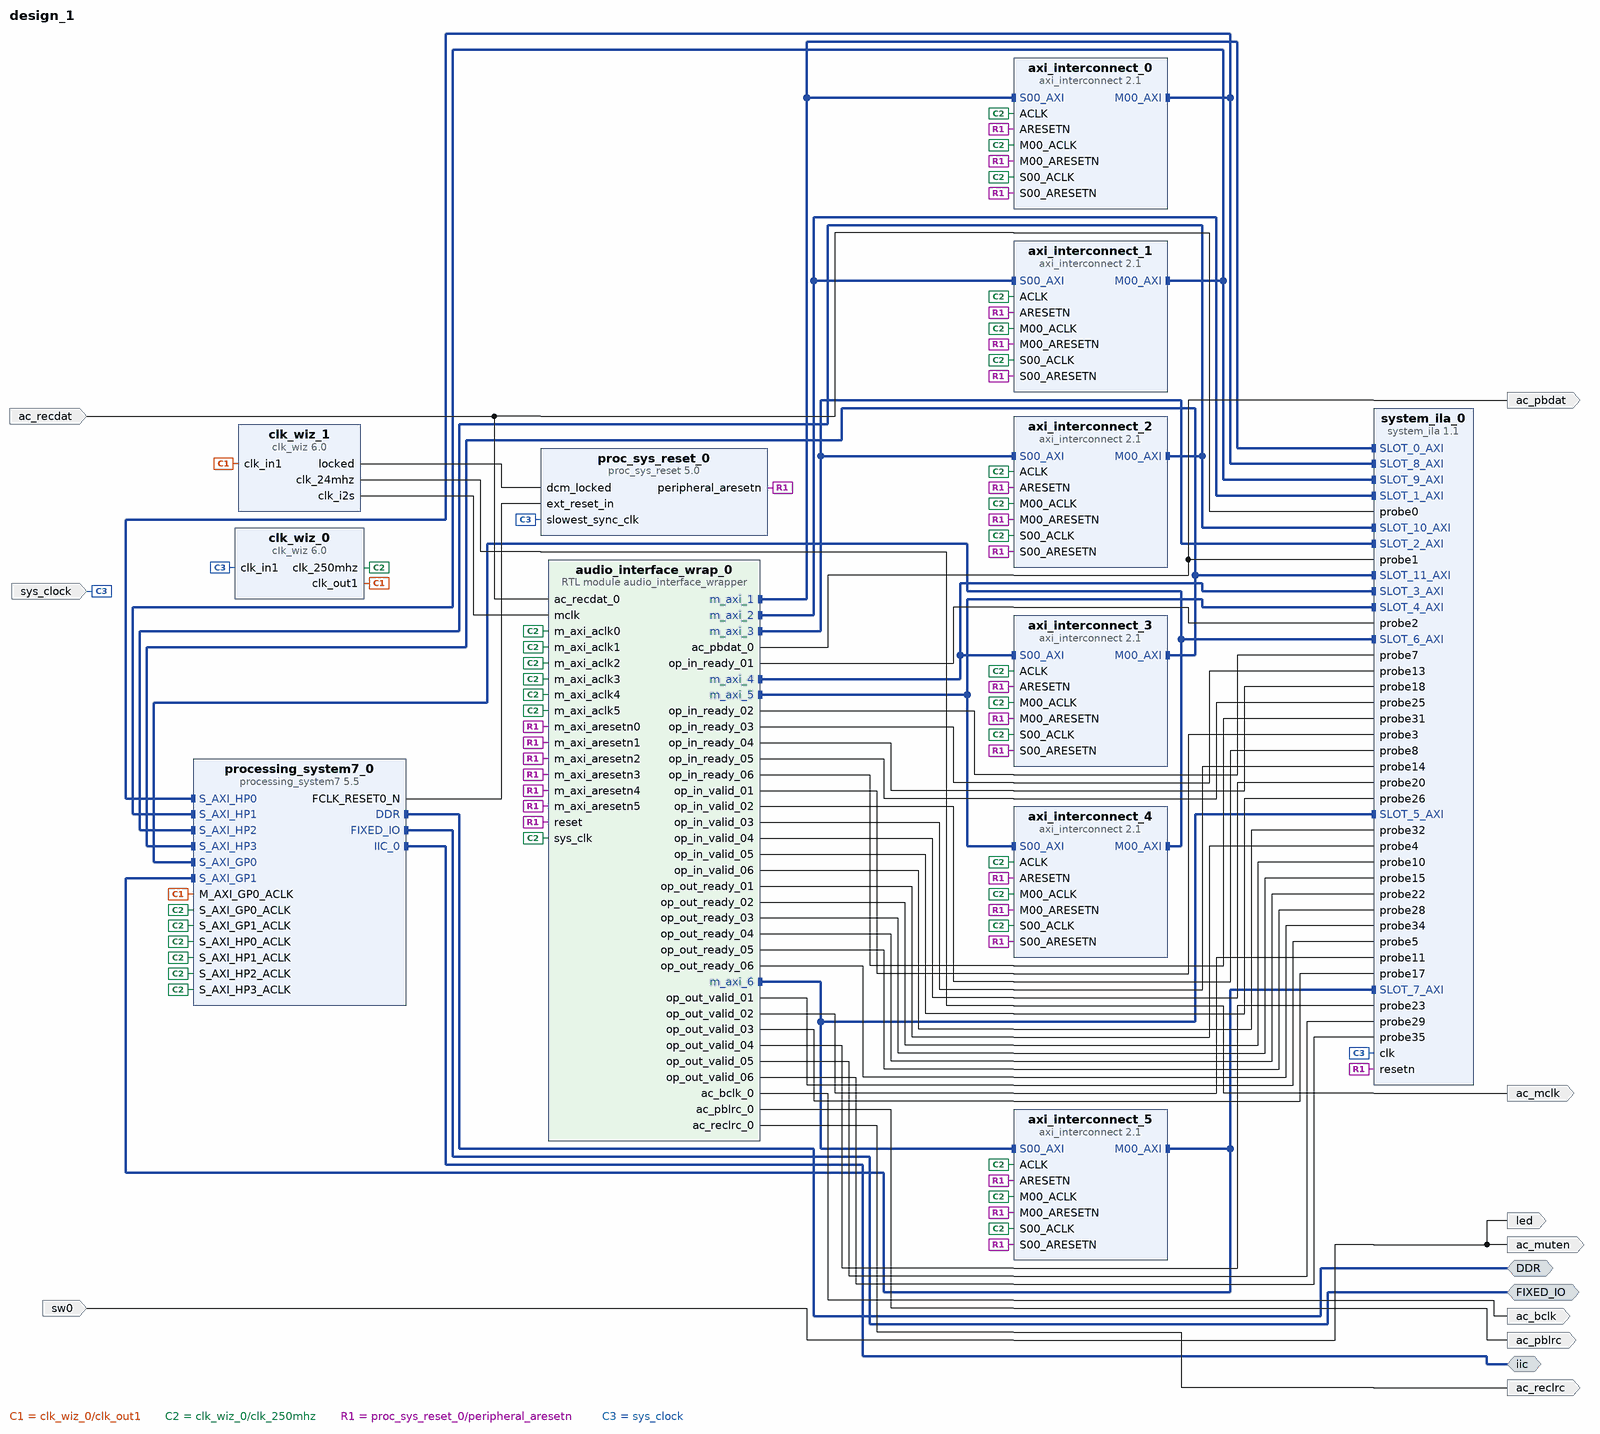
[diagram p0: block diagram of the top level]
# Vivado block design design_1, xc7z020clg400-1, Vivado 2022.2
create_bd_design design_1

create_bd_intf_port -mode Master -vlnv xilinx.com:interface:ddrx_rtl:1.0 DDR
create_bd_intf_port -mode Master -vlnv xilinx.com:display_processing_system7:fixedio_rtl:1.0 FIXED_IO
create_bd_intf_port -mode Master -vlnv xilinx.com:interface:iic_rtl:1.0 iic
create_bd_port -dir O ac_pblrc
create_bd_port -dir O ac_bclk
create_bd_port -dir O ac_pbdat
create_bd_port -dir O ac_reclrc
create_bd_port -dir I ac_recdat
create_bd_port -dir I sys_clock
create_bd_port -dir O -type clk ac_mclk
create_bd_port -dir I sw0
create_bd_port -dir O ac_muten
create_bd_port -dir O led

create_bd_cell -type ip -vlnv xilinx.com:ip:processing_system7:5.5 processing_system7_0
set_property -dict [list \
  CONFIG.PCW_APU_PERIPHERAL_FREQMHZ 667 \
  CONFIG.PCW_ENET0_ENET0_IO {MIO 16 .. 27} \
  CONFIG.PCW_ENET0_GRP_MDIO_ENABLE 1 \
  CONFIG.PCW_ENET0_GRP_MDIO_IO {MIO 52 .. 53} \
  CONFIG.PCW_ENET0_PERIPHERAL_ENABLE 1 \
  CONFIG.PCW_ENET0_RESET_ENABLE 0 \
  CONFIG.PCW_ENET_RESET_ENABLE 1 \
  CONFIG.PCW_ENET_RESET_SELECT {Share reset pin} \
  CONFIG.PCW_GPIO_MIO_GPIO_ENABLE 1 \
  CONFIG.PCW_GPIO_MIO_GPIO_IO MIO \
  CONFIG.PCW_I2C0_I2C0_IO EMIO \
  CONFIG.PCW_I2C0_PERIPHERAL_ENABLE 1 \
  CONFIG.PCW_I2C_PERIPHERAL_FREQMHZ 111.111115 \
  CONFIG.PCW_I2C_RESET_ENABLE 1 \
  CONFIG.PCW_I2C_RESET_SELECT {Share reset pin} \
  CONFIG.PCW_PRESET_BANK1_VOLTAGE {LVCMOS 1.8V} \
  CONFIG.PCW_QSPI_GRP_FBCLK_ENABLE 1 \
  CONFIG.PCW_QSPI_GRP_FBCLK_IO {MIO 8} \
  CONFIG.PCW_QSPI_GRP_SINGLE_SS_ENABLE 1 \
  CONFIG.PCW_QSPI_GRP_SINGLE_SS_IO {MIO 1 .. 6} \
  CONFIG.PCW_QSPI_PERIPHERAL_ENABLE 1 \
  CONFIG.PCW_QSPI_QSPI_IO {MIO 1 .. 6} \
  CONFIG.PCW_SD0_GRP_CD_ENABLE 1 \
  CONFIG.PCW_SD0_GRP_CD_IO {MIO 47} \
  CONFIG.PCW_SD0_GRP_WP_ENABLE 0 \
  CONFIG.PCW_SD0_PERIPHERAL_ENABLE 1 \
  CONFIG.PCW_SD0_SD0_IO {MIO 40 .. 45} \
  CONFIG.PCW_SDIO_PERIPHERAL_FREQMHZ 50 \
  CONFIG.PCW_SINGLE_QSPI_DATA_MODE x4 \
  CONFIG.PCW_S_AXI_HP0_DATA_WIDTH 32 \
  CONFIG.PCW_S_AXI_HP1_DATA_WIDTH 32 \
  CONFIG.PCW_S_AXI_HP2_DATA_WIDTH 32 \
  CONFIG.PCW_S_AXI_HP3_DATA_WIDTH 32 \
  CONFIG.PCW_UART1_PERIPHERAL_ENABLE 1 \
  CONFIG.PCW_UART1_UART1_IO {MIO 48 .. 49} \
  CONFIG.PCW_UART_PERIPHERAL_FREQMHZ 100 \
  CONFIG.PCW_UIPARAM_DDR_FREQ_MHZ 533.333333 \
  CONFIG.PCW_UIPARAM_DDR_MEMORY_TYPE {DDR 3 (Low Voltage)} \
  CONFIG.PCW_UIPARAM_DDR_PARTNO {MT41K256M16 RE-125} \
  CONFIG.PCW_USB0_PERIPHERAL_ENABLE 1 \
  CONFIG.PCW_USB0_RESET_ENABLE 1 \
  CONFIG.PCW_USB0_RESET_IO {MIO 46} \
  CONFIG.PCW_USB0_USB0_IO {MIO 28 .. 39} \
  CONFIG.PCW_USB_RESET_ENABLE 1 \
  CONFIG.PCW_USB_RESET_SELECT {Share reset pin} \
  CONFIG.PCW_USE_S_AXI_GP0 1 \
  CONFIG.PCW_USE_S_AXI_GP1 1 \
  CONFIG.PCW_USE_S_AXI_HP0 1 \
  CONFIG.PCW_USE_S_AXI_HP1 1 \
  CONFIG.PCW_USE_S_AXI_HP2 1 \
  CONFIG.PCW_USE_S_AXI_HP3 1 \
] [get_bd_cells processing_system7_0]
# 299 more settings of processing_system7_0 are not shown: defaults, MIO pin electricals, DDR timing, and values the tool derives
create_bd_cell -type ip -vlnv xilinx.com:ip:clk_wiz:6.0 clk_wiz_0
set_property -dict [list \
  CONFIG.CLKOUT1_JITTER 161.803 \
  CONFIG.CLKOUT1_PHASE_ERROR 160.491 \
  CONFIG.CLKOUT1_REQUESTED_OUT_FREQ 122.885835 \
  CONFIG.CLKOUT2_JITTER 197.162 \
  CONFIG.CLKOUT2_PHASE_ERROR 160.491 \
  CONFIG.CLKOUT2_REQUESTED_OUT_FREQ 250 \
  CONFIG.CLKOUT2_USED true \
  CONFIG.CLK_OUT2_PORT clk_250mhz \
  CONFIG.MMCM_CLKFBOUT_MULT_F 37.625 \
  CONFIG.MMCM_CLKOUT0_DIVIDE_F 6.125 \
  CONFIG.MMCM_CLKOUT1_DIVIDE 3 \
  CONFIG.MMCM_DIVCLK_DIVIDE 5 \
  CONFIG.NUM_OUT_CLKS 2 \
  CONFIG.USE_LOCKED false \
  CONFIG.USE_RESET false \
] [get_bd_cells clk_wiz_0]
create_bd_cell -type ip -vlnv xilinx.com:ip:clk_wiz:6.0 clk_wiz_1
set_property -dict [list \
  CONFIG.CLKOUT1_JITTER 283.526 \
  CONFIG.CLKOUT1_PHASE_ERROR 290.353 \
  CONFIG.CLKOUT1_REQUESTED_OUT_FREQ 12.288 \
  CONFIG.CLKOUT2_JITTER 252.819 \
  CONFIG.CLKOUT2_PHASE_ERROR 290.353 \
  CONFIG.CLKOUT2_REQUESTED_OUT_FREQ 24.576 \
  CONFIG.CLKOUT2_USED true \
  CONFIG.CLK_OUT1_PORT clk_i2s \
  CONFIG.CLK_OUT2_PORT clk_24mhz \
  CONFIG.MMCM_CLKFBOUT_MULT_F 56.375 \
  CONFIG.MMCM_CLKOUT0_DIVIDE_F 93.875 \
  CONFIG.MMCM_CLKOUT1_DIVIDE 47 \
  CONFIG.MMCM_DIVCLK_DIVIDE 6 \
  CONFIG.NUM_OUT_CLKS 2 \
  CONFIG.USE_RESET false \
] [get_bd_cells clk_wiz_1]
create_bd_cell -type ip -vlnv xilinx.com:ip:proc_sys_reset:5.0 proc_sys_reset_0
create_bd_cell -type ip -vlnv xilinx.com:ip:axi_interconnect:2.1 axi_interconnect_0
set_property -dict {CONFIG.NUM_MI 1} [get_bd_cells axi_interconnect_0]
create_bd_cell -type ip -vlnv xilinx.com:ip:axi_interconnect:2.1 axi_interconnect_1
set_property -dict {CONFIG.NUM_MI 1} [get_bd_cells axi_interconnect_1]
create_bd_cell -type ip -vlnv xilinx.com:ip:axi_interconnect:2.1 axi_interconnect_2
set_property -dict {CONFIG.NUM_MI 1} [get_bd_cells axi_interconnect_2]
create_bd_cell -type ip -vlnv xilinx.com:ip:axi_interconnect:2.1 axi_interconnect_3
set_property -dict {CONFIG.NUM_MI 1} [get_bd_cells axi_interconnect_3]
create_bd_cell -type ip -vlnv xilinx.com:ip:axi_interconnect:2.1 axi_interconnect_4
set_property -dict {CONFIG.NUM_MI 1} [get_bd_cells axi_interconnect_4]
create_bd_cell -type ip -vlnv xilinx.com:ip:axi_interconnect:2.1 axi_interconnect_5
set_property -dict {CONFIG.NUM_MI 1} [get_bd_cells axi_interconnect_5]
create_bd_cell -type ip -vlnv xilinx.com:ip:system_ila:1.1 system_ila_0
set_property -dict {CONFIG.C_MON_TYPE MIX CONFIG.C_NUM_MONITOR_SLOTS 12 CONFIG.C_NUM_OF_PROBES 42} [get_bd_cells system_ila_0]
create_bd_cell -type module -reference audio_interface_wrapper audio_interface_wrap_0

# ---- connections ----

connect_bd_intf_net [get_bd_intf_pins audio_interface_wrap_0/m_axi_1] [get_bd_intf_pins axi_interconnect_0/S00_AXI]
connect_bd_intf_net [get_bd_intf_pins audio_interface_wrap_0/m_axi_1] [get_bd_intf_pins system_ila_0/SLOT_0_AXI]
connect_bd_intf_net [get_bd_intf_pins audio_interface_wrap_0/m_axi_2] [get_bd_intf_pins axi_interconnect_1/S00_AXI]
connect_bd_intf_net [get_bd_intf_pins audio_interface_wrap_0/m_axi_2] [get_bd_intf_pins system_ila_0/SLOT_1_AXI]
connect_bd_intf_net [get_bd_intf_pins audio_interface_wrap_0/m_axi_3] [get_bd_intf_pins axi_interconnect_2/S00_AXI]
connect_bd_intf_net [get_bd_intf_pins audio_interface_wrap_0/m_axi_3] [get_bd_intf_pins system_ila_0/SLOT_2_AXI]
connect_bd_intf_net [get_bd_intf_pins audio_interface_wrap_0/m_axi_4] [get_bd_intf_pins axi_interconnect_3/S00_AXI]
connect_bd_intf_net [get_bd_intf_pins audio_interface_wrap_0/m_axi_4] [get_bd_intf_pins system_ila_0/SLOT_3_AXI]
connect_bd_intf_net [get_bd_intf_pins audio_interface_wrap_0/m_axi_5] [get_bd_intf_pins axi_interconnect_4/S00_AXI]
connect_bd_intf_net [get_bd_intf_pins audio_interface_wrap_0/m_axi_5] [get_bd_intf_pins system_ila_0/SLOT_4_AXI]
connect_bd_intf_net [get_bd_intf_pins audio_interface_wrap_0/m_axi_6] [get_bd_intf_pins axi_interconnect_5/S00_AXI]
connect_bd_intf_net [get_bd_intf_pins audio_interface_wrap_0/m_axi_6] [get_bd_intf_pins system_ila_0/SLOT_5_AXI]
connect_bd_intf_net [get_bd_intf_pins axi_interconnect_0/M00_AXI] [get_bd_intf_pins processing_system7_0/S_AXI_HP0]
connect_bd_intf_net [get_bd_intf_pins axi_interconnect_0/M00_AXI] [get_bd_intf_pins system_ila_0/SLOT_8_AXI]
connect_bd_intf_net [get_bd_intf_pins axi_interconnect_1/M00_AXI] [get_bd_intf_pins processing_system7_0/S_AXI_HP1]
connect_bd_intf_net [get_bd_intf_pins axi_interconnect_1/M00_AXI] [get_bd_intf_pins system_ila_0/SLOT_9_AXI]
connect_bd_intf_net [get_bd_intf_pins axi_interconnect_2/M00_AXI] [get_bd_intf_pins processing_system7_0/S_AXI_HP2]
connect_bd_intf_net [get_bd_intf_pins axi_interconnect_2/M00_AXI] [get_bd_intf_pins system_ila_0/SLOT_10_AXI]
connect_bd_intf_net [get_bd_intf_pins axi_interconnect_3/M00_AXI] [get_bd_intf_pins processing_system7_0/S_AXI_HP3]
connect_bd_intf_net [get_bd_intf_pins axi_interconnect_3/M00_AXI] [get_bd_intf_pins system_ila_0/SLOT_11_AXI]
connect_bd_intf_net [get_bd_intf_pins axi_interconnect_4/M00_AXI] [get_bd_intf_pins processing_system7_0/S_AXI_GP0]
connect_bd_intf_net [get_bd_intf_pins axi_interconnect_4/M00_AXI] [get_bd_intf_pins system_ila_0/SLOT_6_AXI]
connect_bd_intf_net [get_bd_intf_pins axi_interconnect_5/M00_AXI] [get_bd_intf_pins processing_system7_0/S_AXI_GP1]
connect_bd_intf_net [get_bd_intf_pins axi_interconnect_5/M00_AXI] [get_bd_intf_pins system_ila_0/SLOT_7_AXI]
connect_bd_intf_net [get_bd_intf_ports DDR] [get_bd_intf_pins processing_system7_0/DDR]
connect_bd_intf_net [get_bd_intf_ports FIXED_IO] [get_bd_intf_pins processing_system7_0/FIXED_IO]
connect_bd_intf_net [get_bd_intf_ports iic] [get_bd_intf_pins processing_system7_0/IIC_0]
connect_bd_net [get_bd_ports ac_recdat] [get_bd_pins system_ila_0/probe0] [get_bd_pins audio_interface_wrap_0/ac_recdat_0]
connect_bd_net [get_bd_pins audio_interface_wrap_0/ac_bclk_0] [get_bd_ports ac_bclk]
connect_bd_net [get_bd_pins audio_interface_wrap_0/ac_pbdat_0] [get_bd_ports ac_pbdat] [get_bd_pins system_ila_0/probe1]
connect_bd_net [get_bd_pins audio_interface_wrap_0/ac_pblrc_0] [get_bd_ports ac_pblrc]
connect_bd_net [get_bd_pins audio_interface_wrap_0/ac_reclrc_0] [get_bd_ports ac_reclrc]
connect_bd_net [get_bd_pins audio_interface_wrap_0/op_in_ready_01] [get_bd_pins system_ila_0/probe2]
connect_bd_net [get_bd_pins audio_interface_wrap_0/op_in_ready_02] [get_bd_pins system_ila_0/probe7]
connect_bd_net [get_bd_pins audio_interface_wrap_0/op_in_ready_03] [get_bd_pins system_ila_0/probe13]
connect_bd_net [get_bd_pins audio_interface_wrap_0/op_in_ready_04] [get_bd_pins system_ila_0/probe18]
connect_bd_net [get_bd_pins audio_interface_wrap_0/op_in_ready_05] [get_bd_pins system_ila_0/probe25]
connect_bd_net [get_bd_pins audio_interface_wrap_0/op_in_ready_06] [get_bd_pins system_ila_0/probe31]
connect_bd_net [get_bd_pins audio_interface_wrap_0/op_in_valid_01] [get_bd_pins system_ila_0/probe3]
connect_bd_net [get_bd_pins audio_interface_wrap_0/op_in_valid_02] [get_bd_pins system_ila_0/probe8]
connect_bd_net [get_bd_pins audio_interface_wrap_0/op_in_valid_03] [get_bd_pins system_ila_0/probe14]
connect_bd_net [get_bd_pins audio_interface_wrap_0/op_in_valid_04] [get_bd_pins system_ila_0/probe20]
connect_bd_net [get_bd_pins audio_interface_wrap_0/op_in_valid_05] [get_bd_pins system_ila_0/probe26]
connect_bd_net [get_bd_pins audio_interface_wrap_0/op_in_valid_06] [get_bd_pins system_ila_0/probe32]
connect_bd_net [get_bd_pins audio_interface_wrap_0/op_out_ready_01] [get_bd_pins system_ila_0/probe4]
connect_bd_net [get_bd_pins audio_interface_wrap_0/op_out_ready_02] [get_bd_pins system_ila_0/probe10]
connect_bd_net [get_bd_pins audio_interface_wrap_0/op_out_ready_03] [get_bd_pins system_ila_0/probe15]
connect_bd_net [get_bd_pins audio_interface_wrap_0/op_out_ready_04] [get_bd_pins system_ila_0/probe22]
connect_bd_net [get_bd_pins audio_interface_wrap_0/op_out_ready_05] [get_bd_pins system_ila_0/probe28]
connect_bd_net [get_bd_pins audio_interface_wrap_0/op_out_ready_06] [get_bd_pins system_ila_0/probe34]
connect_bd_net [get_bd_pins audio_interface_wrap_0/op_out_valid_01] [get_bd_pins system_ila_0/probe5]
connect_bd_net [get_bd_pins audio_interface_wrap_0/op_out_valid_02] [get_bd_pins system_ila_0/probe11]
connect_bd_net [get_bd_pins audio_interface_wrap_0/op_out_valid_03] [get_bd_pins system_ila_0/probe17]
connect_bd_net [get_bd_pins audio_interface_wrap_0/op_out_valid_04] [get_bd_pins system_ila_0/probe23]
connect_bd_net [get_bd_pins audio_interface_wrap_0/op_out_valid_05] [get_bd_pins system_ila_0/probe29]
connect_bd_net [get_bd_pins audio_interface_wrap_0/op_out_valid_06] [get_bd_pins system_ila_0/probe35]
connect_bd_net [get_bd_pins clk_wiz_0/clk_out1] [get_bd_pins clk_wiz_1/clk_in1] [get_bd_pins processing_system7_0/M_AXI_GP0_ACLK]
connect_bd_net [get_bd_pins clk_wiz_1/clk_24mhz] [get_bd_ports ac_mclk]
connect_bd_net -net clk_wiz_1_clk_i2s [get_bd_pins clk_wiz_0/clk_250mhz] \
  [get_bd_pins axi_interconnect_0/ACLK] [get_bd_pins axi_interconnect_1/ACLK] [get_bd_pins axi_interconnect_2/ACLK] \
  [get_bd_pins axi_interconnect_3/ACLK] [get_bd_pins axi_interconnect_4/ACLK] [get_bd_pins axi_interconnect_5/ACLK] \
  [get_bd_pins axi_interconnect_5/S00_ACLK] [get_bd_pins axi_interconnect_5/M00_ACLK] \
  [get_bd_pins axi_interconnect_2/S00_ACLK] [get_bd_pins axi_interconnect_2/M00_ACLK] \
  [get_bd_pins axi_interconnect_4/S00_ACLK] [get_bd_pins axi_interconnect_4/M00_ACLK] \
  [get_bd_pins axi_interconnect_1/S00_ACLK] [get_bd_pins axi_interconnect_1/M00_ACLK] \
  [get_bd_pins axi_interconnect_0/S00_ACLK] [get_bd_pins axi_interconnect_0/M00_ACLK] \
  [get_bd_pins axi_interconnect_3/S00_ACLK] [get_bd_pins axi_interconnect_3/M00_ACLK] \
  [get_bd_pins processing_system7_0/S_AXI_GP0_ACLK] [get_bd_pins processing_system7_0/S_AXI_GP1_ACLK] \
  [get_bd_pins processing_system7_0/S_AXI_HP0_ACLK] [get_bd_pins processing_system7_0/S_AXI_HP1_ACLK] \
  [get_bd_pins processing_system7_0/S_AXI_HP2_ACLK] [get_bd_pins processing_system7_0/S_AXI_HP3_ACLK] \
  [get_bd_pins audio_interface_wrap_0/sys_clk] [get_bd_pins audio_interface_wrap_0/m_axi_aclk0] \
  [get_bd_pins audio_interface_wrap_0/m_axi_aclk1] [get_bd_pins audio_interface_wrap_0/m_axi_aclk2] \
  [get_bd_pins audio_interface_wrap_0/m_axi_aclk3] [get_bd_pins audio_interface_wrap_0/m_axi_aclk4] \
  [get_bd_pins audio_interface_wrap_0/m_axi_aclk5]
connect_bd_net [get_bd_pins clk_wiz_1/clk_i2s] [get_bd_pins audio_interface_wrap_0/mclk]
connect_bd_net [get_bd_pins clk_wiz_1/locked] [get_bd_pins proc_sys_reset_0/dcm_locked]
connect_bd_net [get_bd_pins proc_sys_reset_0/peripheral_aresetn] \
  [get_bd_pins axi_interconnect_0/ARESETN] [get_bd_pins axi_interconnect_1/ARESETN] [get_bd_pins axi_interconnect_2/ARESETN] \
  [get_bd_pins axi_interconnect_3/ARESETN] [get_bd_pins axi_interconnect_4/ARESETN] [get_bd_pins axi_interconnect_5/ARESETN] \
  [get_bd_pins axi_interconnect_5/M00_ARESETN] [get_bd_pins axi_interconnect_5/S00_ARESETN] \
  [get_bd_pins axi_interconnect_2/S00_ARESETN] [get_bd_pins axi_interconnect_2/M00_ARESETN] \
  [get_bd_pins axi_interconnect_4/S00_ARESETN] [get_bd_pins axi_interconnect_4/M00_ARESETN] \
  [get_bd_pins axi_interconnect_1/S00_ARESETN] [get_bd_pins axi_interconnect_1/M00_ARESETN] \
  [get_bd_pins axi_interconnect_0/S00_ARESETN] [get_bd_pins axi_interconnect_0/M00_ARESETN] \
  [get_bd_pins axi_interconnect_3/S00_ARESETN] [get_bd_pins axi_interconnect_3/M00_ARESETN] [get_bd_pins system_ila_0/resetn] \
  [get_bd_pins audio_interface_wrap_0/reset] [get_bd_pins audio_interface_wrap_0/m_axi_aresetn0] \
  [get_bd_pins audio_interface_wrap_0/m_axi_aresetn1] [get_bd_pins audio_interface_wrap_0/m_axi_aresetn2] \
  [get_bd_pins audio_interface_wrap_0/m_axi_aresetn3] [get_bd_pins audio_interface_wrap_0/m_axi_aresetn4] \
  [get_bd_pins audio_interface_wrap_0/m_axi_aresetn5]
connect_bd_net [get_bd_pins processing_system7_0/FCLK_RESET0_N] [get_bd_pins proc_sys_reset_0/ext_reset_in]
connect_bd_net -net sw0_1 [get_bd_ports sw0] [get_bd_ports ac_muten] [get_bd_ports led]
connect_bd_net [get_bd_ports sys_clock] [get_bd_pins clk_wiz_0/clk_in1] [get_bd_pins proc_sys_reset_0/slowest_sync_clk] [get_bd_pins system_ila_0/clk]

# ---- address map ----
assign_bd_address -offset 0x00000000 -range 1G -target_address_space [get_bd_addr_spaces audio_interface_wrap_0/m_axi_1] [get_bd_addr_segs processing_system7_0/S_AXI_HP0/HP0_DDR_LOWOCM]
assign_bd_address -offset 0x00000000 -range 1G -target_address_space [get_bd_addr_spaces audio_interface_wrap_0/m_axi_2] [get_bd_addr_segs processing_system7_0/S_AXI_HP1/HP1_DDR_LOWOCM]
assign_bd_address -offset 0x00000000 -range 1G -target_address_space [get_bd_addr_spaces audio_interface_wrap_0/m_axi_3] [get_bd_addr_segs processing_system7_0/S_AXI_HP2/HP2_DDR_LOWOCM]
assign_bd_address -offset 0x00000000 -range 1G -target_address_space [get_bd_addr_spaces audio_interface_wrap_0/m_axi_4] [get_bd_addr_segs processing_system7_0/S_AXI_HP3/HP3_DDR_LOWOCM]
assign_bd_address -offset 0x00000000 -range 1G -target_address_space [get_bd_addr_spaces audio_interface_wrap_0/m_axi_5] [get_bd_addr_segs processing_system7_0/S_AXI_GP0/GP0_DDR_LOWOCM]
assign_bd_address -offset 0x40000000 -range 1G -target_address_space [get_bd_addr_spaces audio_interface_wrap_0/m_axi_5] [get_bd_addr_segs processing_system7_0/S_AXI_GP0/GP0_M_AXI_GP0]
assign_bd_address -offset 0xE0000000 -range 4M -target_address_space [get_bd_addr_spaces audio_interface_wrap_0/m_axi_5] [get_bd_addr_segs processing_system7_0/S_AXI_GP0/GP0_IOP]
assign_bd_address -offset 0xFC000000 -range 16M -target_address_space [get_bd_addr_spaces audio_interface_wrap_0/m_axi_5] [get_bd_addr_segs processing_system7_0/S_AXI_GP0/GP0_QSPI_LINEAR]
assign_bd_address -offset 0x00000000 -range 1G -target_address_space [get_bd_addr_spaces audio_interface_wrap_0/m_axi_6] [get_bd_addr_segs processing_system7_0/S_AXI_GP1/GP1_DDR_LOWOCM]
assign_bd_address -offset 0x40000000 -range 1G -target_address_space [get_bd_addr_spaces audio_interface_wrap_0/m_axi_6] [get_bd_addr_segs processing_system7_0/S_AXI_GP1/GP1_M_AXI_GP0]
assign_bd_address -offset 0xE0000000 -range 4M -target_address_space [get_bd_addr_spaces audio_interface_wrap_0/m_axi_6] [get_bd_addr_segs processing_system7_0/S_AXI_GP1/GP1_IOP]
assign_bd_address -offset 0xFC000000 -range 16M -target_address_space [get_bd_addr_spaces audio_interface_wrap_0/m_axi_6] [get_bd_addr_segs processing_system7_0/S_AXI_GP1/GP1_QSPI_LINEAR]

validate_bd_design
save_bd_design
